# Altium schematic sheet 1A19J2_1A20J17 B.SchDoc: Cable Assembly
size A; Date: 1/1/17; CompanyName: National Center for Atmospheric Research; DrawnBy: Rich Erickson; Engineer: 4/27/17; Organization: Earth Observing Laboratory; Address1: 3450 Mitchell Lane; Address2: FL1; Address3: 3090 Center Green Dr.; Address4: Boulder, CO. 80301; DocumentNumber: 1A19J2_1A20J17; Revision: B; SheetNumber: 1; SheetTotal: 1; Department: Remote Sensing Facility; ModifiedDate: 7/17/97; ImagePath: 5/10/18; ProjectName: Ka Band; Application_BuildNumber: 5
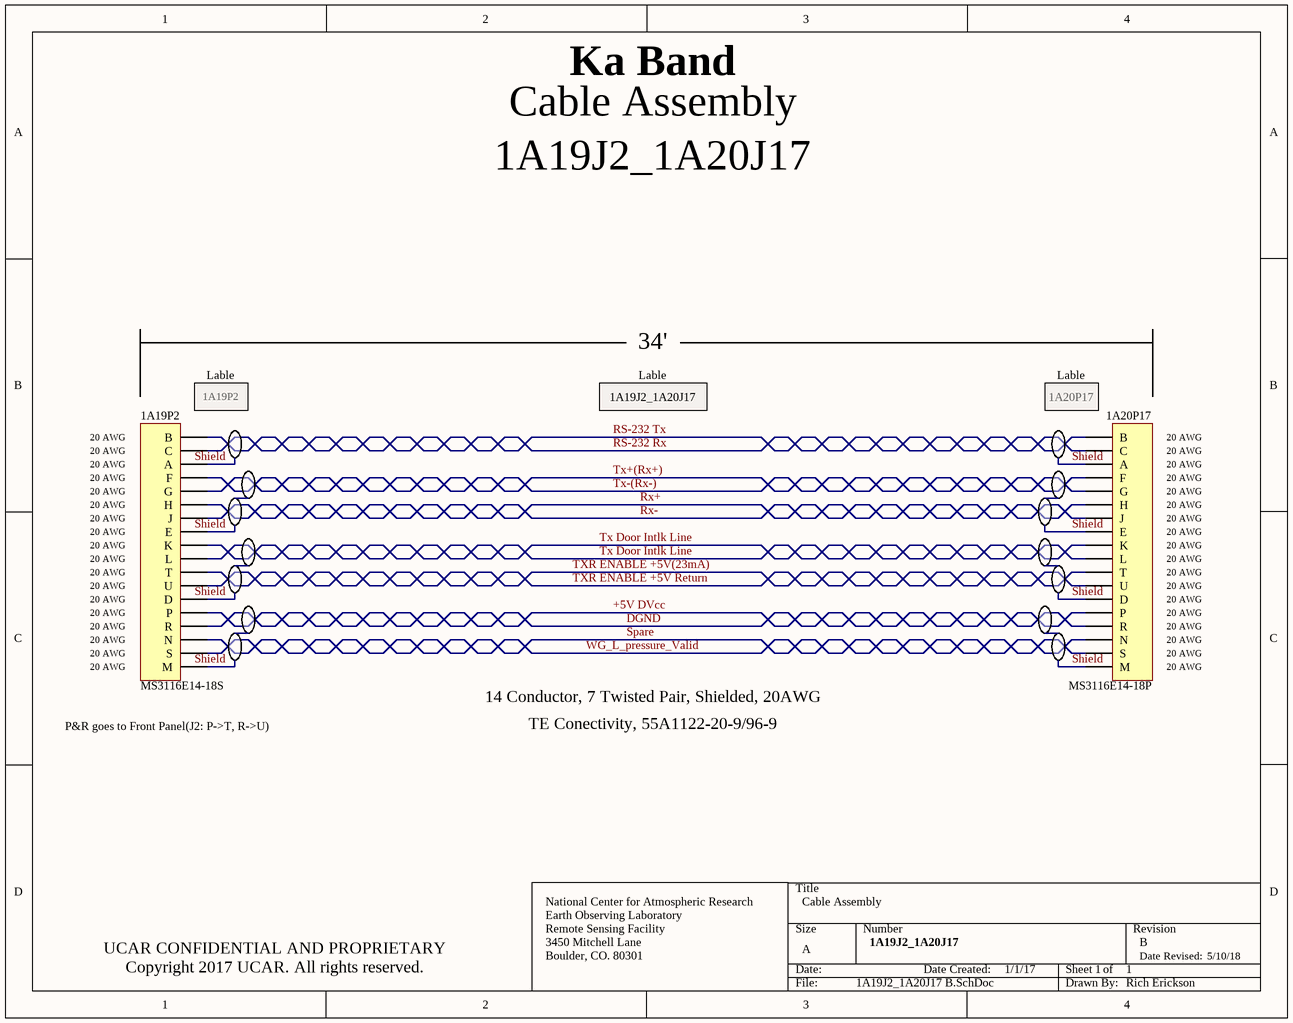
[diagram p0: 1A19J2_1A20J17 B.SchDoc]

## Parts
1A19P2  MS3116E14-18S  [HDR1X18]
1A20P17  MS3116E14-18P  [HDR1X18]

## Nets
+5V DVcc: 1A19P2.14(P) 1A20P17.14(P)
DGND: 1A19P2.15(R) 1A20P17.15(R)
RS-232 Rx: 1A19P2.2(C) 1A20P17.2(C)
RS-232 Tx: 1A19P2.1(B) 1A20P17.1(B)
Rx+: 1A19P2.6(H) 1A20P17.6(H)
Rx-: 1A19P2.7(J) 1A20P17.7(J)
Shield: 1A20P17.3(A) 1A20P17.8(E) 1A20P17.13(D) 1A20P17.18(M)
Spare: 1A19P2.16(N) 1A20P17.16(N)
Tx Door Intlk Line: 1A19P2.9(K) 1A19P2.10(L) 1A20P17.9(K) 1A20P17.10(L)
Tx+(Rx+): 1A19P2.4(F) 1A20P17.4(F)
Tx-(Rx-): 1A19P2.5(G) 1A20P17.5(G)
TXR ENABLE +5V Return: 1A19P2.12(U) 1A20P17.12(U)
TXR ENABLE +5V(23mA): 1A19P2.11(T) 1A20P17.11(T)
WG_L_pressure_Valid: 1A19P2.17(S) 1A20P17.17(S)

Not connected (* = marked no-connect by the designer): 1A19P2 3(A) 8(E) 13(D) 18(M)

## Notes on the sheet
- 34'
- 20 AWG
- (near 1A19P2) 1A19P2
- Lable
- 1A19J2_1A20J17
- (near 1A20P17) 1A20P17
- 14 Conductor, 7 Twisted Pair, Shielded, 20AWG
- P&R goes to Front Panel(J2: P->T, R->U)
- TE Conectivity, 55A1122-20-9/96-9
- UCAR CONFIDENTIAL AND PROPRIETARY
  Copyright 2017 UCAR. All rights reserved.
- Date Created:
- Date Revised:
- Labels drawn without touching a wire or pin: Shield

## Library data of the parts
1A19P2 1A20P17 = Header 18: Header, 18-Pin; LatestRevisionDate: 17-Jul-2002; LatestRevisionNote: Re-released for DXP Platform.; Publisher: Altium Limited